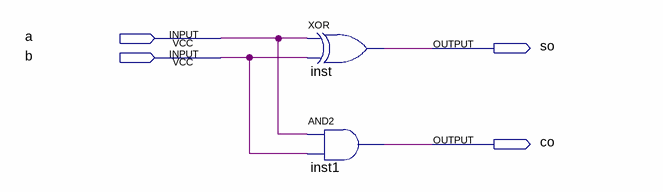
[diagram p0: schematic sheet]
// Quartus schematic hadder.bdf as structural Verilog: 2 symbols, 4 pins
module hadder (
  input  a,
  input  b,
  output so,
  output co
);

  xor inst (so, a, b);
  and inst1 (co, a, b);
endmodule
